# EAGLE schematic v21_layout_mockup (EAGLE 9.6.2)
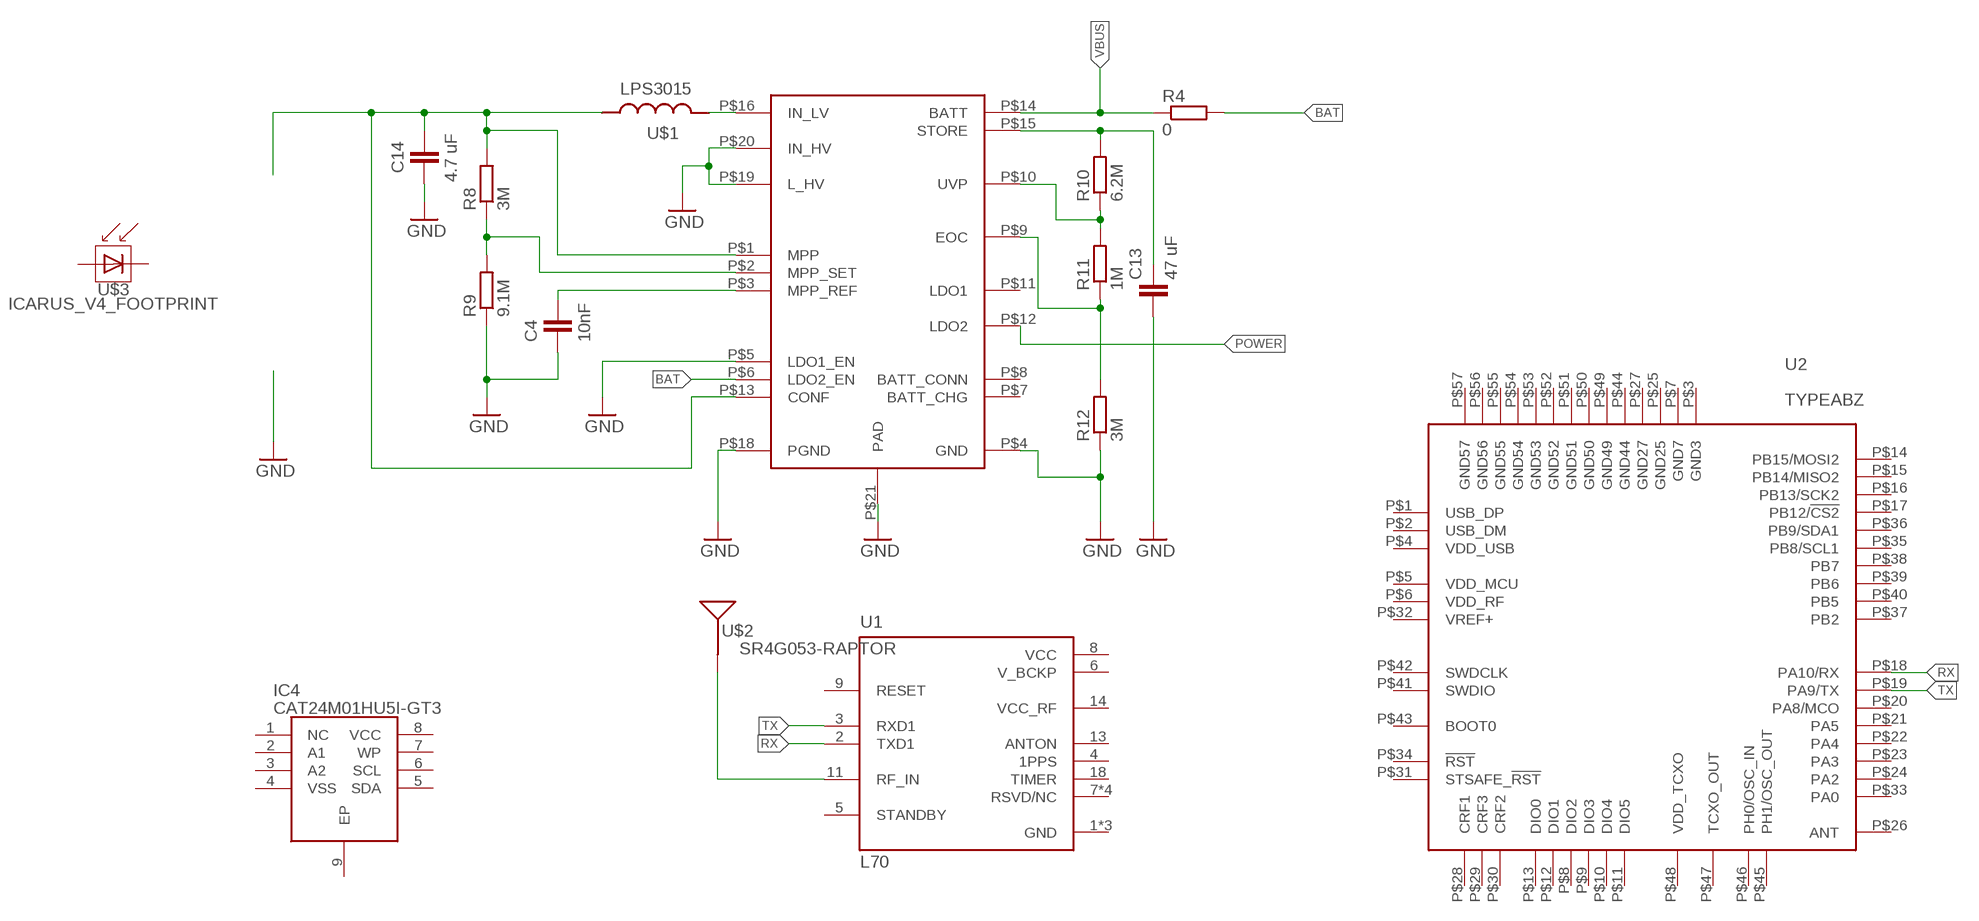
[diagram p0: schematic, sheet 1]

## Parts
C4  10nF  C-EUC0201  [C0201]
C13  47 uF  C-EUC0805K  [C0805K]
C14  4.7 uF  C-EUC0201  [C0201]
IC4  CAT24M01HU5I-GT3  [SON50P300X200X55-9N]
R4  0  R-EU_R0201  [R0201]
R8  3M  R-EU_R0201  [R0201]
R9  9.1M  R-EU_R0201  [R0201]
R10  6.2M  R-EU_R0201  [R0201]
R11  1M  R-EU_R0201  [R0201]
R12  3M  R-EU_R0201  [R0201]
U1  L70  [XCVR_L70]
U2  TYPEABZ  [TYPEABZ]
U4  SPV1050  [SPV1050]
U$1  LPS3015  [LPS_3015]
U$2  SR4G053-RAPTOR  [SR4G053]
U$3  ICARUS_V4_FOOTPRINT  [ICARUS_FULL_FOOTPRINT]

## Nets
BAT [battery]: R4.2 U4.P$6(LDO2_EN)
GND: C4.2 C13.2 C14.2 R9.1 R12.1 U4.P$4(GND) U4.P$5(LDO1_EN) U4.P$18(PGND) U4.P$19(L_HV) U4.P$20(IN_HV) U4.P$21(PAD)
N$1: U1.11(RF_IN) U$2.P$3(SIGNAL)
N$4: U4.P$16(IN_LV) U$1.P$2
N$6: R8.1 R9.2 U4.P$2(MPP_SET)
N$7 [battery]: C14.1 R8.2 U4.P$1(MPP) U4.P$13(CONF) U$1.P$1
N$8: R10.1 R11.2 U4.P$10(UVP)
N$9: R11.1 R12.2 U4.P$9(EOC)
N$12: C13.1 R10.2 U4.P$15(STORE)
N$13: C4.1 U4.P$3(MPP_REF)
POWER [power]: U4.P$12(LDO2)
RX: U1.2(TXD1) U2.P$18(PA10/RX)
TX: U1.3(RXD1) U2.P$19(PA9/TX)
VBUS: R4.1 U4.P$14(BATT)
Unconnected: IC4.1(NC) IC4.2(A1) IC4.3(A2) IC4.5(SDA) IC4.6(SCL) IC4.7(WP) IC4.9(EP) U1.4(1PPS) U1.5(STANDBY) U1.7(RSVD/NC) U1.9(RESET) U1.13(ANTON) U1.14(VCC_RF) U1.15(RSVD/NC) U1.16(RSVD/NC) U1.17(RSVD/NC) U1.18(TIMER) U2.P$1(USB_DP) U2.P$2(USB_DM) U2.P$8(DIO2) U2.P$9(DIO3) U2.P$10(DIO4) U2.P$11(DIO5) U2.P$12(DIO1) U2.P$13(DIO0) U2.P$14(PB15/MOSI2) U2.P$15(PB14/MISO2) U2.P$16(PB13/SCK2) U2.P$17(PB12/!CS2) U2.P$20(PA8/MCO) U2.P$21(PA5) U2.P$22(PA4) U2.P$23(PA3) U2.P$24(PA2) U2.P$26(ANT) U2.P$28(CRF1) U2.P$29(CRF3) U2.P$30(CRF2) U2.P$31(STSAFE_!RST) U2.P$33(PA0) U2.P$34(!RST) U2.P$35(PB8/SCL1) U2.P$36(PB9/SDA1) U2.P$37(PB2) U2.P$38(PB7) U2.P$39(PB6) U2.P$40(PB5) U2.P$41(SWDIO) U2.P$42(SWDCLK) U2.P$43(BOOT0) U2.P$45(PH1/OSC_OUT) U2.P$46(PH0/OSC_IN) U2.P$47(TCXO_OUT) U4.P$7(BATT_CHG) U4.P$8(BATT_CONN) U4.P$11(LDO1) U$3.P$1(PLUS) U$3.P$3(MINUS)

## Power pins joined to a net without a drawn wire
GND: U1.1(GND) U1.10(GND) U1.12(GND)
GND3: U2.P$3(GND3)
GND7: U2.P$7(GND7)
GND25: U2.P$25(GND25)
GND27: U2.P$27(GND27)
GND44: U2.P$44(GND44)
GND49: U2.P$49(GND49)
GND50: U2.P$50(GND50)
GND51: U2.P$51(GND51)
GND52: U2.P$52(GND52)
GND53: U2.P$53(GND53)
GND54: U2.P$54(GND54)
GND55: U2.P$55(GND55)
GND56: U2.P$56(GND56)
GND57: U2.P$57(GND57)
V_BCKP: U1.6(V_BCKP)
VCC: IC4.8(VCC) U1.8(VCC)
VDD_MCU: U2.P$5(VDD_MCU)
VDD_RF: U2.P$6(VDD_RF)
VDD_TCXO: U2.P$48(VDD_TCXO)
VDD_USB: U2.P$4(VDD_USB)
VREF+: U2.P$32(VREF+)
VSS: IC4.4(VSS)

## Library data of the parts
C4 C13 C14 = rcl:C-EU: CAPACITOR, European symbol; SPICEPREFIX: C
IC4 = CAT24M01HU5I-GT3-CorrectedV2:CAT24M01HU5I-GT3: EEPROM 1MB I2C SERIAL EEPROM Source: Datasheet <http://www.onsemi.com/pub/Collateral/CAT24M01-D.PDF>; ALLIED_NUMBER: 70300250; ALLIED_PRICE-STOCK: http://www.alliedelec.com/on-semiconductor-cat24m01hu5i-gt3/70300250/; DESCRIPTION: EEPROM 1MB I2C SERIAL EEPROM; HEIGHT: 0.55mm; MANUFACTURER_NAME: ON Semiconductor; MANUFACTURER_PART_NUMBER: CAT24M01HU5I-GT3; MOUSER_PART_NUMBER: 863-CAT24M01HU5I-GT3; MOUSER_PRICE-STOCK: https://www.mouser.com/Search/Refine.aspx?Keyword=863-CAT24M01HU5I-GT3; RS_PART_NUMBER: 7814831P; RS_PRICE-STOCK: http://uk.rs-online.com/web/p/products/7814831P
R4 R8-R12 = rcl:R-EU_: RESISTOR, European symbol; SPICEPREFIX: R
U1 = L70:L70: GPS Module Check prices <https://pricing.snapeda.com/parts/L70/Quectel/view-part?ref=eda>; AVAILABILITY: Warning; DESCRIPTION: L70, an SMD type module, brings the high performance of MTK positioning engine to the industrial applications with compact profile, ultra low power consumption and fast positioning capability.; MF: Quectel; MP: L70; PACKAGE: 2920 Quectel; PRICE: None
U2 = Kris:TYPEABZ: CMWX1ZZABZ-078
U4 = STM-SPV1050_V2:SPV1050
U$1 = coilcraft_custom:LPS3015
U$2 = Antenova:SR4G053-RAPTOR
U$3 = TrisolX_Solar_Cells:ICARUS_V4_FOOTPRINT

## Net classes
1 power: width 0.152 mm
3 battery: width 0.152 mm